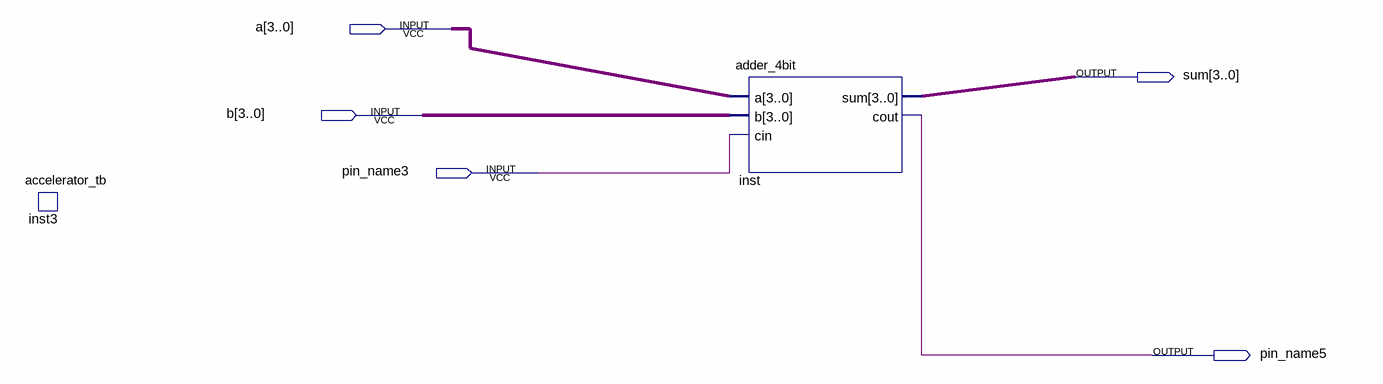
[diagram p0: schematic sheet]
// Quartus schematic TopLevel.bdf as structural Verilog: 2 symbols, 5 pins
module TopLevel (
  input  [3:0] a,
  input  [3:0] b,
  input  pin_name3,
  output [3:0] sum,
  output pin_name5
);

  accelerator_tb inst3 ();
  adder_4bit inst (.a(a), .b(b), .cin(pin_name3), .sum(sum), .cout(pin_name5));
endmodule
